# Altium schematic sheet Power_supply.SchDoc
size 420 x 297 mm; Address1: Address1; Address2: Address2; Address3: Address3; Address4: Address4; DocumentNumber: *Э3; SheetNumber: 4; SheetTotal: 11; DocumentType: Схема электрическая *
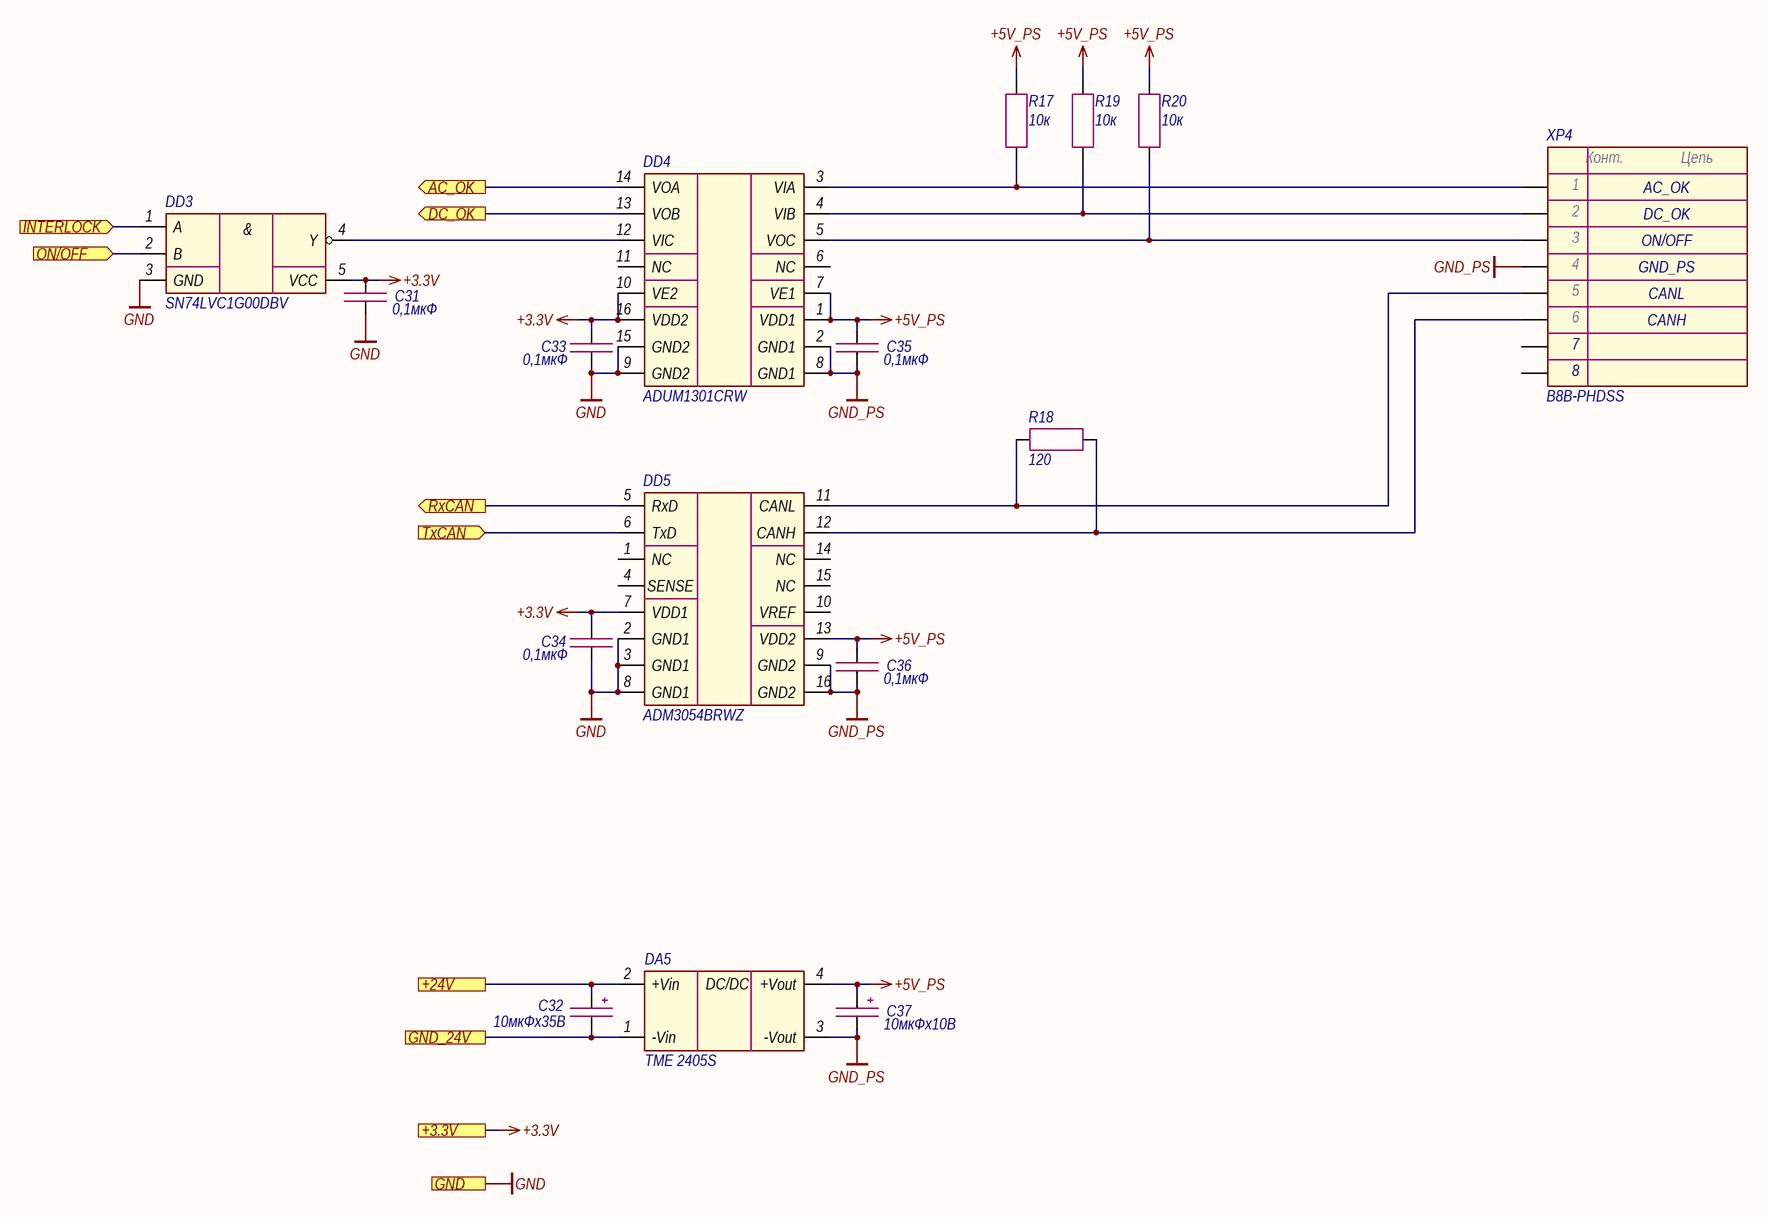
[diagram p0: Power_supply.SchDoc]

## Parts
C31  0,1мкФ  [CAP_0603]
C32  10мкФх35B  [CAP_C]
C33  0,1мкФ  [CAP_0603]
C34  0,1мкФ  [CAP_0603]
C35  0,1мкФ  [CAP_0603]
C36  0,1мкФ  [CAP_0603]
C37  10мкФх10B  [CAP_A]
DA5  TME 2405S  [TME (SIP-4)]
DD3  SN74LVC1G00DBV  [SOT-23-5]
DD4  ADUM1301CRW  [SOIC-16W]
DD5  ADM3054BRWZ  [SOIC-16W]
R17  10к  [RES_0603]
R18  120  [RES_0805]
R19  10к  [RES_0603]
R20  10к  [RES_0603]
XP4  B8B-PHDSS  [B8B-PHDSS]

## Ports
+3.3V (see Main[1B], Ethernet[3D], Fiber_interlock[2C], Hardwiring[3D], LD_driver[1D], Protection[2C]), +24V (see Main[1B], Hardwiring[3C], Indication[1C], LD_driver[1D]), AC_OK (out, see Main[2B]), DC_OK (out, see Main[2B]), GND (see Main[1B], Ethernet[3D], Fiber_interlock[2C], Guide_laser[1C], Hardwiring[3D], Indication[1C], LD_driver[1D], Protection[2C]), GND_24V (see Main[1B], Hardwiring[3C], Indication[1C], LD_driver[1D]), INTERLOCK (in, see Main[1B], LD_driver[1A], Protection[4B]), ON/OFF (in, see Main[1B]), RxCAN (out, see Main[2B]), TxCAN (in, see Main[2B])

## Nets
+3.3V: C31.1 C33.1 C34.1 DD3.5(VCC) DD4.10(VE2) DD4.16(VDD2) DD5.7(VDD1) ; port +3.3V
+5V_PS: C35.1 C36.1 C37.1 DA5.4(+Vout) DD4.1(VDD1) DD4.7(VE1) DD5.13(VDD2) R17.1 R19.1 R20.1
GND: C31.2 C33.2 C34.2 DD3.3(GND) DD4.9(GND2) DD4.15(GND2) DD5.2(GND1) DD5.3(GND1) DD5.8(GND1) ; port GND
GND_PS: C35.2 C36.2 C37.2 DA5.3(-Vout) DD4.2(GND1) DD4.8(GND1) DD5.9(GND2) DD5.16(GND2) XP4.4
+24V: C32.1 DA5.2(+Vin) ; port +24V
AC_OK: DD4.14(VOA) ; port AC_OK
DC_OK: DD4.13(VOB) ; port DC_OK
GND_24V: C32.2 DA5.1(-Vin) ; port GND_24V
INTERLOCK: DD3.1(A) ; port INTERLOCK
ON/OFF: DD3.2(B) ; port ON/OFF
RxCAN: DD5.5(RxD) ; port RxCAN
TxCAN: DD5.6(TxD) ; port TxCAN
NetDD3_4: DD3.4(Y) DD4.12(VIC)
NetDD4_3: DD4.3(VIA) R17.2 XP4.1
NetDD4_4: DD4.4(VIB) R19.2 XP4.2
NetDD4_5: DD4.5(VOC) R20.2 XP4.3
NetDD5_11: DD5.11(CANL) R18.1 XP4.5
NetDD5_12: DD5.12(CANH) R18.2 XP4.6

Not connected (* = marked no-connect by the designer): DD4 6(NC) 11(NC); DD5 1(NC) 4(SENSE) 10(VREF) 14(NC) 15(NC); XP4 7 8

## Notes on the sheet
- AC_OK
- DC_OK
- ON/OFF
- GND_PS
- CANH
- CANL
- Подп. и дата
- Инв. № дубл.
- Взам. инв. №
- Инв. № подл.
- Изм.
- Лист
- № докум.
- Подп.
- Дата
- Копировал
- Формат А3
- (in symbol Connector-8) Конт.; Цепь
- (in symbol SN74LVC1G00) &
- (in symbol TME) DC/DC

## Library data of the parts
C31 C33-C36 = Capacitor: Manufacturer: Murata; Model: GRM188R71H104KA93D; Value: 0,1мкФ; Document: *
C32 = Capacitor_Polar: Model: TECAP, 10 мкФ, 35 В, тип C, 10%; Value: 10мкФх35B; Document: *; Manufacturer: *
C37 = Capacitor_Polar: Model: TECAP, 10 мкФ, 10 В, тип A, 10%; Value: 10мкФх10B; Document: *; Manufacturer: *
DA5 = TME: Manufacturer: Traco Power; Model: TME 2405S; Document: *
DD3 = SN74LVC1G00: Manufacturer: Texas Instruments; Model: SN74LVC1G00DBV; Document: *
DD4 = ADUM1301: Manufacturer: Analog Devices; Model: ADUM1301CRW; Document: *
DD5 = ADM3054BRWZ: Manufacturer: Analog Devices; Model: ADM3054BRWZ; Document: *
R17 R19 R20 = Resistor: Manufacturer: Yageo; Model: RC0603FR-0710KL; Value: 10к; Document: *
R18 = Resistor: Manufacturer: Yageo; Model: RC0805FR-07120RL; Value: 120; Document: *
XP4 = Connector-8: Manufacturer: JST; Model: B8B-PHDSS; Document: *